# EAGLE design ME433_HW2_2 (EAGLE 8.1.0)
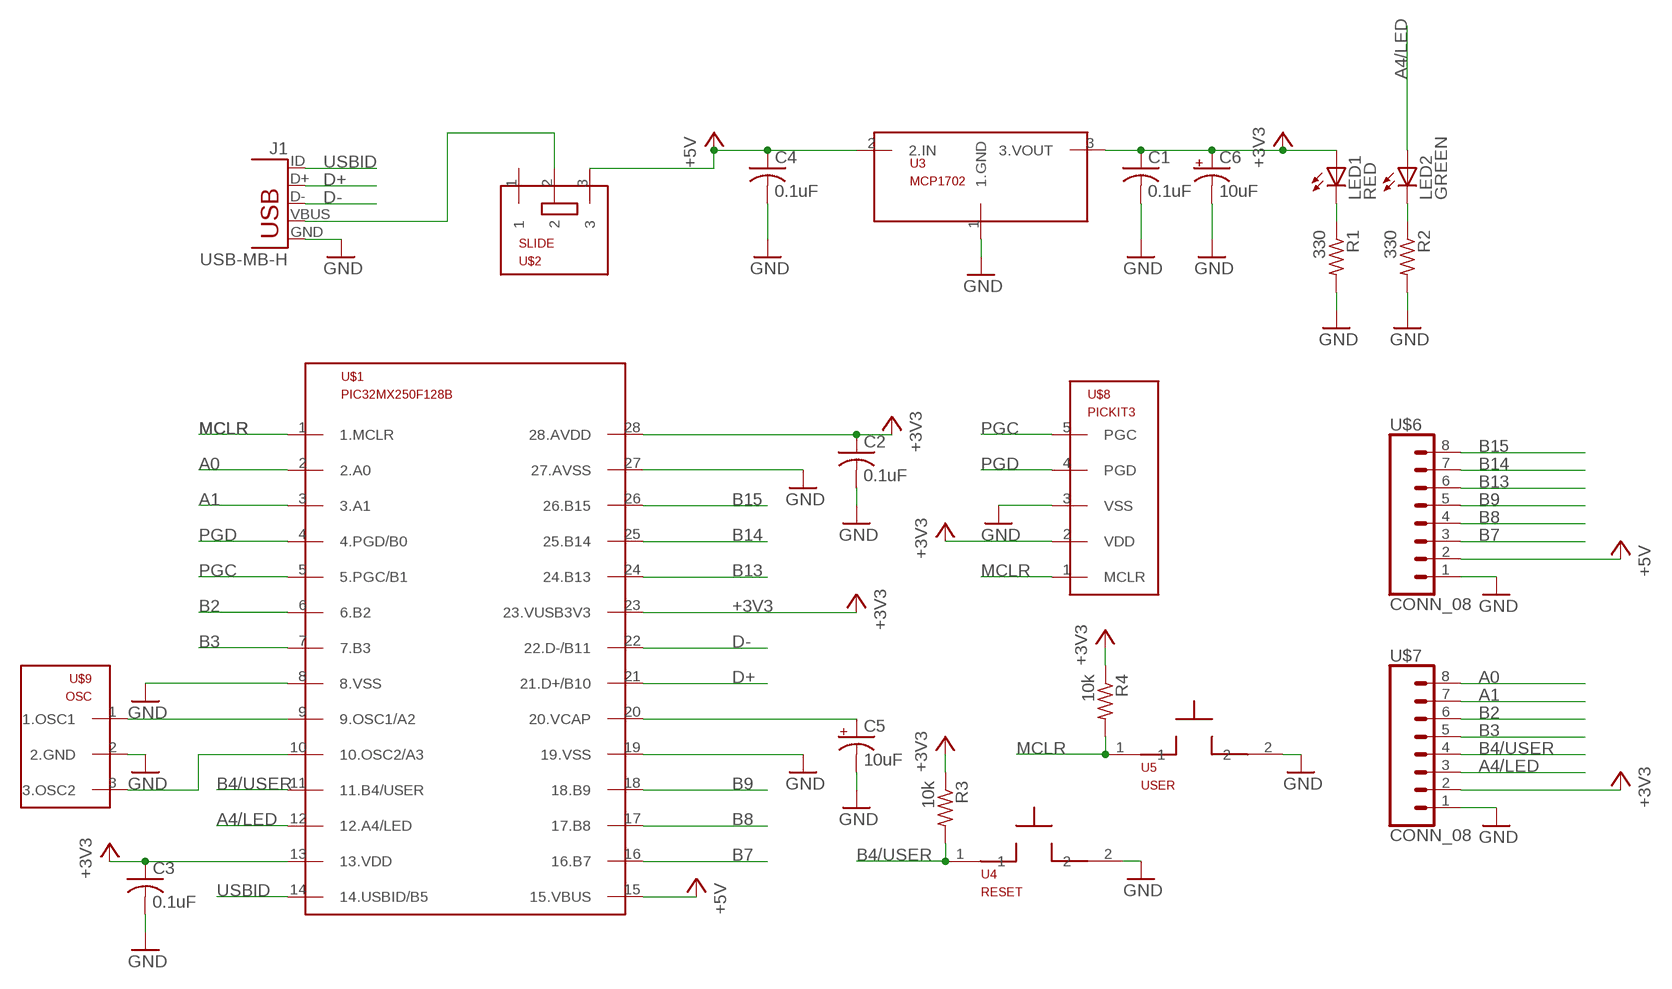
[diagram p0: schematic, sheet 1]

## Parts
C1  0.1uF  C-US025-025X050  [C025-025X050]
C2  0.1uF  C-US025-025X050  [C025-025X050]
C3  0.1uF  C-US025-025X050  [C025-025X050]
C4  0.1uF  C-US025-025X050  [C025-025X050]
C5  10uF  CPOL-USB45181B  [B45181B]
C6  10uF  CPOL-USB45181B  [B45181B]
J1  USB-MB-H  [USB-MB-H]
LED1  RED  LED3MM  [LED3MM]
LED2  GREEN  LED3MM  [LED3MM]
R1  330  R-US_0207/10  [0207/10]
R2  330  R-US_0207/10  [0207/10]
R3  10k  R-US_0207/10  [0207/10]
R4  10k  R-US_0207/10  [0207/10]
U3  MCP1702  [TO92]
U4  RESET  PB  [PB]
U5  USER  PB  [PB]
U$1  PIC32MX250F128B  [DIL28-3]
U$2  SLIDE  [SLIDE]
U$6  CONN_08  [1X08]
U$7  CONN_08  [1X08]
U$8  PICKIT3  [1X05]
U$9  OSC  [OSC]

## Nets
+3V3: C1.1 C2.1 C3.1 C6.+ LED1.A R3.1 R4.1 U3.3(3.VOUT) U$1.13(13.VDD) U$1.23(23.VUSB3V3) U$1.28(28.AVDD) U$7.2 U$8.2(VDD)
+5V: C4.1 U3.2(2.IN) U$1.15(15.VBUS) U$2.3 U$6.2
A0: U$1.2(2.A0) U$7.8
A1: U$1.3(3.A1) U$7.7
A4/LED: LED2.A U$1.12(12.A4/LED) U$7.3
B2: U$1.6(6.B2) U$7.6
B3: U$1.7(7.B3) U$7.5
B4/USER: R3.2 U4.1 U$1.11(11.B4/USER) U$7.4
B7: U$1.16(16.B7) U$6.3
B8: U$1.17(17.B8) U$6.4
B9: U$1.18(18.B9) U$6.5
B13: U$1.24(24.B13) U$6.6
B14: U$1.25(25.B14) U$6.7
B15: U$1.26(26.B15) U$6.8
D+: J1.D+ U$1.21(21.D+/B10)
D-: J1.D- U$1.22(22.D-/B11)
GND: C1.2 C2.2 C3.2 C4.2 C5.- C6.- J1.GND R1.2 R2.2 U3.1(1.GND) U4.2 U5.2 U$1.8(8.VSS) U$1.19(19.VSS) U$1.27(27.AVSS) U$6.1 U$7.1 U$8.3(VSS) U$9.2(2.GND)
MCLR: R4.2 U5.1 U$1.1(1.MCLR) U$8.1(MCLR)
N$2: LED1.K(C) R1.1
N$3: LED2.K(C) R2.1
N$5: U$1.10(10.OSC2/A3) U$9.3(3.OSC2)
N$6: U$1.9(9.OSC1/A2) U$9.1(1.OSC1)
N$7: C5.+ U$1.20(20.VCAP)
PGC: U$1.5(5.PGC/B1) U$8.5(PGC)
PGD: U$1.4(4.PGD/B0) U$8.4(PGD)
USBID: J1.ID U$1.14(14.USBID/B5)
VBUS: J1.VBUS U$2.2
Unconnected: U$2.1

## Library data of the parts
C1-C4 = resistor:C-US: CAPACITOR, American symbol
C5 C6 = resistor:CPOL-US: POLARIZED CAPACITOR, American symbol
J1 = ME433_HW2:USB: USB Connectors USB-B-PTH is fully proven SKU : PRT-00139/CONN-08278 USB-miniB is fully proven SKU : PRT-00587 USB-A-PCB is untested. USB-A-H is throughly reviewed, but untested. Spark Fun Electronics SKU : PRT-00437 USB-B-SMT is throughly reviewed, but untested. Needs silkscreen touching up. USB-A-S has not been used/tested USB-MB-H has not been used/tested USB-MICROB has been used. CONN-09505
LED1 LED2 = led:LED: LED OSRAM: - CHIPLED LG R971, LG N971, LY N971, LG Q971, LY Q971, LO R971, LY R971 LH N974, LH R974 LS Q976, LO Q976, LY Q976 LO Q996 - Hyper CHIPLED LW Q18S LB Q993, LB Q99A, LB R99A - SideLED LS A670, LO A670, LY A670, LG A670, LP A670 LB A673, LV A673, LT A673, LW A673 LH A674 LY A675 LS A676, LA A676, LO A676, LY A676, LW A676 LS A679, LY A679, LG A679 - Hyper Micro SIDELED® LS Y876, LA Y876, LO Y876, LY Y876 LT Y87S - SmartLED LW L88C, LW L88S LB L89C, LB L89S, LG L890 LS L89K, LO L89K, LY L89K LS L896, LA L896, LO L896, LY L896 - TOPLED LS T670, LO T670, LY T670, LG T670, LP T670 LSG T670, LSP T670, LSY T670, LOP T670, LYG T670 LG T671, LOG T671, LSG T671 LB T673, LV T673, LT T673, LW T673 LH T674 LS T676, LA T676, LO T676, LY T676, LB T676, LH T676, LSB T676, LW T676 LB T67C, LV T67C, LT T67C, LS T67K, LO T67K, LY T67K, LW E67C LS E67B, LA E67B, LO E67B, LY E67B, LB E67C, LV E67C, LT E67C LW T67C LS T679, LY T679, LG T679 LS T770, LO T770, LY T770, LG T770, LP T770 LB T773, LV T773, LT T773, LW T773 LH T774 LS E675, LA E675, LY E675, LS T675 LS T776, LA T776, LO T776, LY T776, LB T776 LHGB T686 LT T68C, LB T68C - Hyper Mini TOPLED® LB M676 - Mini TOPLED Santana® LG M470 LS M47K, LO M47K, LY M47K Source: http://www.osram.convergy.de LUXEON: - LUMILED® LXK2-PW12-R00, LXK2-PW12-S00, LXK2-PW14-U00, LXK2-PW14-V00 LXK2-PM12-R00, LXK2-PM12-S00, LXK2-PM14-U00 LXK2-PE12-Q00, LXK2-PE12-R00, LXK2-PE12-S00, LXK2-PE14-T00, LXK2-PE14-U00 LXK2-PB12-K00, LXK2-PB12-L00, LXK2-PB12-M00, LXK2-PB14-N00, LXK2-PB14-P00, LXK2-PB14-Q00 LXK2-PR12-L00, LXK2-PR12-M00, LXK2-PR14-Q00, LXK2-PR14-R00 LXK2-PD12-Q00, LXK2-PD12-R00, LXK2-PD12-S00 LXK2-PH12-R00, LXK2-PH12-S00 LXK2-PL12-P00, LXK2-PL12-Q00, LXK2-PL12-R00 Source: www.luxeon.com KINGBRIGHT: KA-3528ASYC Source: www.kingbright.com
R1-R4 = resistor:R-US_: RESISTOR, American symbol
U3 = ME433_HW2:MCP1702
U4 U5 = ME433_HW2:PB
U$1 = ME433_HW2:PIC32MX250F128B
U$2 = ME433_HW2:SLIDE
U$6 U$7 = ME433_HW2:CONN_08
U$8 = ME433_HW2:PICKIT3
U$9 = ME433_HW2:OSC

## Board
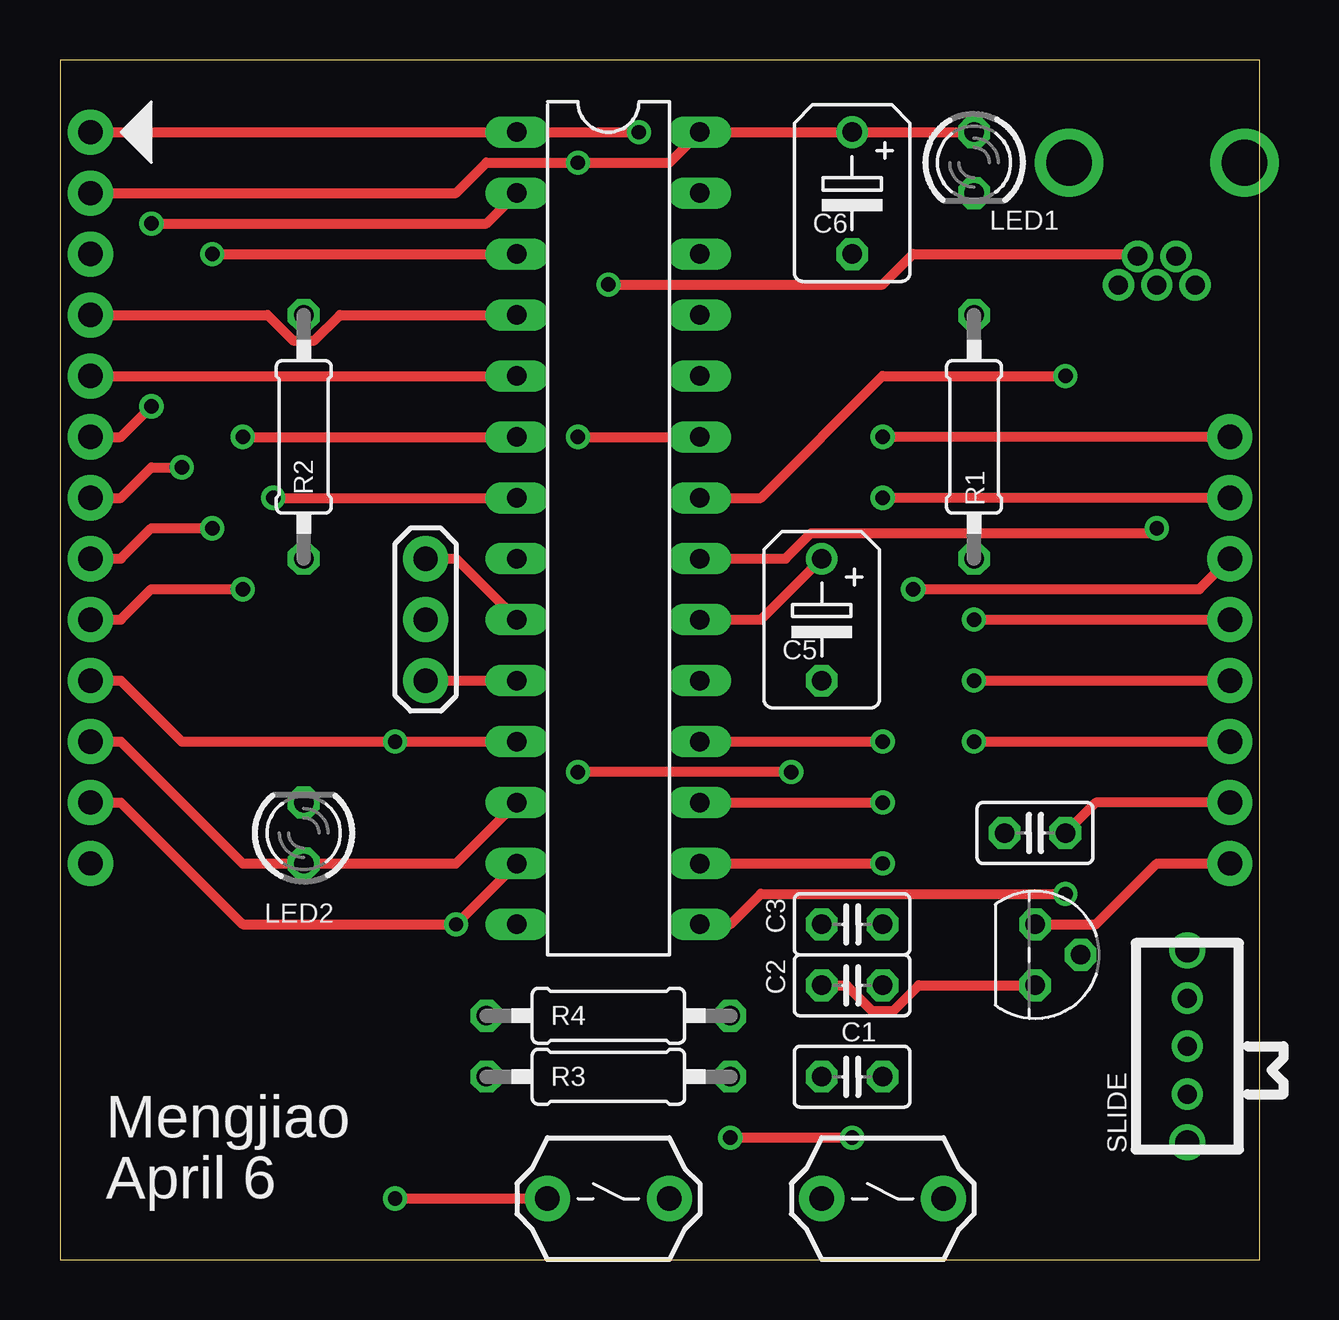
[diagram p1: board, top side]
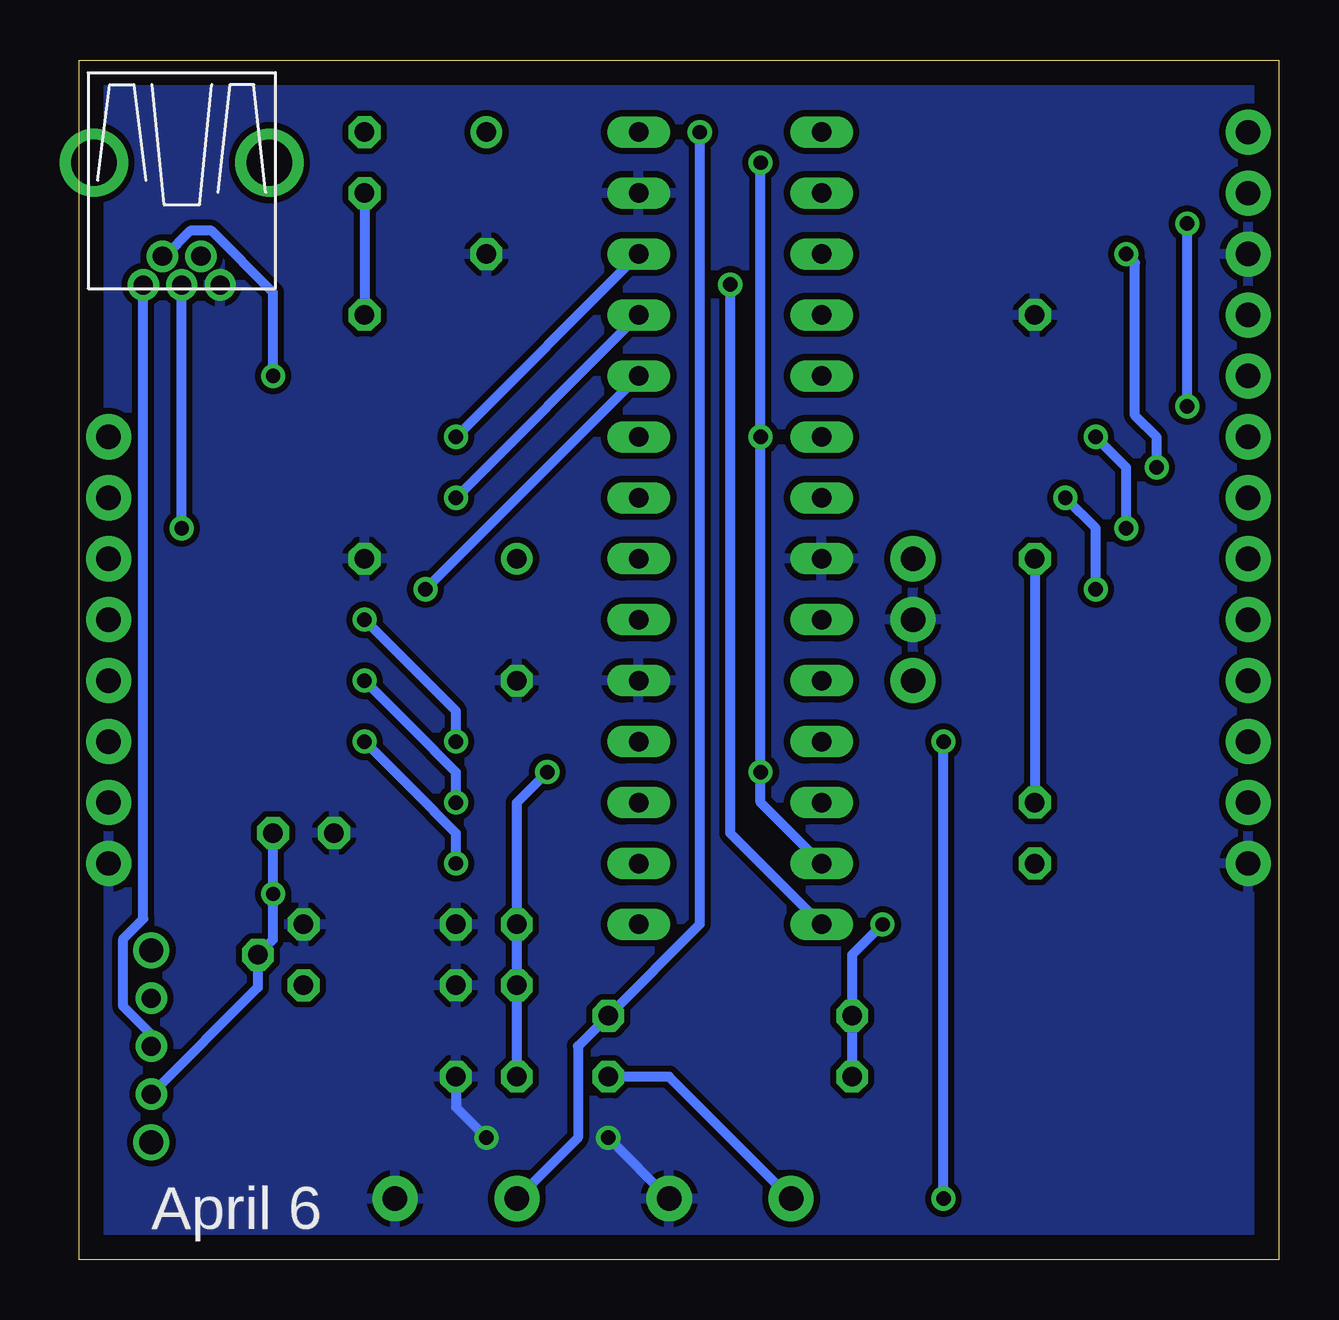
[diagram p2: board, bottom side, seen from below]

Size 50 x 50 mm. Coordinates in mm from the lower left corner, seen from the top.
Outline: 0,0 50,0 50,50 0,50 0,0
Copper layers (1*16): Top 0.035mm / dielectric 1.5mm / Bottom 0.035mm
Design rules "default": minimum track width 10mil, minimum drill 24mil, track to track 8mil, track to pad 8mil, pad to pad 8mil, via to via 8mil, smd to smd 8mil, copper to edge 40mil, drill to drill 8mil, minimum pad ring 10mil, minimum via ring 8mil, stop-mask expansion 4mil, vias tented up to drill 0mil, thermal gap 10mil

### Footprints (pad centres in the part's own frame; a part is rotated, then mirrored left to right if it is on the bottom)
C025-025X050 = drill 0.813 octagon: 1 -1.27,0; 2 1.27,0
B45181B = drill 0.813: + -2.54,0 | drill 0.813 octagon: - 2.54,0
USB-MB-H = drill 0.8: D+ 5.1,0; D- 3.9,0.8; GND 5.1,-1.6; ID 3.9,-0.8; VBUS 5.1,1.6 | drill 1.9: P$6 0,-3.65; P$7 0,3.65
LED3MM = drill 0.813 octagon: A -1.27,0; K 1.27,0
0207/10 = drill 0.813 octagon: 1 -5.08,0; 2 5.08,0
TO92 = drill 0.813 octagon: 1 -1.27,0; 2 0,1.905; 3 1.27,0
PB = drill 1.016 pad 1.88: 1 -2.54,0; 2 2.54,0
DIL28-3 = drill 0.813 long: 1 -16.51,-3.81; 2 -13.97,-3.81; 3 -11.43,-3.81; 4 -8.89,-3.81; 5 -6.35,-3.81; 6 -3.81,-3.81; 7 -1.27,-3.81; 8 1.27,-3.81; 9 3.81,-3.81; 10 6.35,-3.81; 11 8.89,-3.81; 12 11.43,-3.81; 13 13.97,-3.81; 14 16.51,-3.81; 15 16.51,3.81; 16 13.97,3.81; 17 11.43,3.81; 18 8.89,3.81; 19 6.35,3.81; 20 3.81,3.81; 21 1.27,3.81; 22 -1.27,3.81; 23 -3.81,3.81; 24 -6.35,3.81; 25 -8.89,3.81; 26 -11.43,3.81; 27 -13.97,3.81; 28 -16.51,3.81
SLIDE = drill 0.8: 1 -2,0; 2 0,0; 3 2,0 | drill 1: P$1 -4,0; P$2 4,0
1X08 = drill 1.016 pad 1.88: 1 0,0; 2 2.54,0; 3 5.08,0; 4 7.62,0; 5 10.16,0; 6 12.7,0; 7 15.24,0; 8 17.78,0
1X05 = drill 1.016 pad 1.88: 1 0,0; 2 2.54,0; 3 5.08,0; 4 7.62,0; 5 10.16,0
OSC = drill 1.016 pad 1.88: 1 -2.54,0; 2 0,0; 3 2.54,0

### Placement (x,y rotation side)
C1  33.02,7.62 0 top
C2  33.02,11.43 0 top
C3  33.02,13.97 0 top
C4  40.64,17.78 180 top
C5  31.75,26.67 270 top
C6  33.02,44.45 270 top
J1  45.72,45.72 270 top
LED1  38.1,45.72 270 top
LED2  10.16,17.78 90 top
R1  38.1,34.29 270 top
R2  10.16,34.29 90 top
R3  22.86,7.62 0 top
R4  22.86,10.16 0 top
U3  40.64,12.7 270 top
U4  22.86,2.54 0 top
U5  34.29,2.54 0 top
U$1  22.86,30.48 270 top
U$2  46.99,8.89 270 top
U$6  48.77,16.51 90 top
U$7  1.27,16.51 90 top
U$8  1.27,46.99 270 top
U$9  15.24,26.67 270 top

### Tracks (layer width: path | path; a pad name or v marks a point on that pad's centre or on a via)
+3V3  (via drill 0.6)
  Top 0.406: v21.59,34.29 U$1.23 | U$8.2 16.51,44.45 17.78,45.72 v21.59,45.72 25.4,45.72 U$1.28 C6.+ LED1.A | U$7.2 2.54,19.05 7.62,13.97 v16.51,13.97 U$1.13 | v30.48,20.32 v21.59,20.32 | C2.1 32.78,11.43 33.85,10.36 34.73,10.36 35.8,11.43 U3.3
  Bottom 0.406: U$1.13 21.59,19.05 v21.59,20.32 v21.59,34.29 v21.59,45.72 | v16.51,13.97 17.78,12.7 R4.1 R3.1 | C1.1 C2.1 C3.1 31.75,19.05 v30.48,20.32
+5V  (via drill 0.6)
  Top 0.406: U$1.15 27.94,13.97 29.21,15.24 v41.91,15.24 | U$6.2 43.18,19.05 C4.1
  Bottom 0.406: C4.1 v41.91,15.24 41.91,13.34 U3.2 | 42.55,12.61 U3.2 | U3.2 42.55,11.34 U$2.3
A0  (via drill 0.6)
  Top 0.406: U$7.8 2.54,34.29 v3.81,35.56 | v3.81,43.18 17.78,43.18 U$1.2
  Bottom 0.406: v3.81,35.56 v3.81,43.18
A1  (via drill 0.6)
  Top 0.406: U$7.7 2.54,31.75 3.81,33.02 v5.08,33.02 | v6.35,41.91 U$1.3
  Bottom 0.406: v5.08,33.02 5.08,34.27 5.99,35.18 5.99,41.55 v6.35,41.91
A4/LED
  Top 0.406: U$7.3 2.54,21.59 7.62,16.51 LED2.A 16.51,16.51 U$1.12
B2  (via drill 0.6)
  Top 0.406: U$7.6 2.54,29.21 3.81,30.48 v6.35,30.48 | v7.62,34.29 U$1.6
  Bottom 0.406: v6.35,30.48 6.35,33.02 v7.62,34.29
B3  (via drill 0.6)
  Top 0.406: U$7.5 2.54,26.67 3.81,27.94 v7.62,27.94 | v8.89,31.75 U$1.7
  Bottom 0.406: v7.62,27.94 7.62,30.48 v8.89,31.75
B4/USER  (via drill 0.6)
  Top 0.406: U$7.4 2.54,24.13 5.08,21.59 v13.97,21.59 U$1.11 | U4.1 v13.97,2.54
  Bottom 0.406: R3.2 25.4,7.62 U4.1 | v13.97,2.54 v13.97,21.59
B7  (via drill 0.6)
  Top 0.406: U$1.16 v34.29,16.51 | v38.1,21.59 U$6.3
  Bottom 0.406: v38.1,21.59 35.2,18.69 35.2,18.67 34.29,17.76 v34.29,16.51
B8  (via drill 0.6)
  Top 0.406: U$1.17 v34.29,19.05 | v38.1,24.13 U$6.4
  Bottom 0.406: v38.1,24.13 35.2,21.23 35.2,21.21 34.29,20.3 v34.29,19.05
B9  (via drill 0.6)
  Top 0.406: U$1.18 v34.29,21.59 | v38.1,26.67 U$6.5
  Bottom 0.406: v34.29,21.59 34.29,22.86 v38.1,26.67
B13  (via drill 0.6)
  Top 0.406: v35.56,27.94 47.5,27.94 U$6.6
  Bottom 0.406: U$1.24 v35.56,27.94
B14  (via drill 0.6)
  Top 0.406: U$6.7 v34.29,31.75
  Bottom 0.406: v34.29,31.75 U$1.25
B15  (via drill 0.6)
  Top 0.406: U$6.8 v34.29,34.29
  Bottom 0.406: v34.29,34.29 U$1.26
D+  (via drill 0.6)
  Top 0.406: U$1.21 30.24,29.21 31.31,30.28 45.52,30.28 v45.72,30.48
  Bottom 0.406: v45.72,30.48 J1.D+
D-  (via drill 0.6)
  Top 0.406: U$1.22 29.21,31.75 34.29,36.83 v41.91,36.83
  Bottom 0.406: J1.D- 46.42,41.82 45.36,42.88 44.48,42.88 41.91,40.31 v41.91,36.83
GND  (via drill 0.6)
  Top 0.406: U3.1 43.18,13.97 45.72,16.51 U$6.1 | v33.02,5.08 v27.94,5.08
  Bottom 0.406: C1.2 34.29,6.35 v33.02,5.08 | v27.94,5.08 U4.2
  pour Bottom (isolate 0.254): 0,49.53 50.8,49.53 50.8,0 0,0
MCLR  (via drill 0.6)
  Top 0.406: U$8.1 U$1.1 v24.13,46.99
  Bottom 0.406: v24.13,46.99 24.13,13.97 R4.2 29.21,8.89 29.21,5.08 U5.1
N$2
  Bottom 0.406: LED1.K R1.1
N$3
  Bottom 0.406: R2.1 LED2.K
N$5
  Top 0.406: U$9.3 U$1.10
N$6
  Top 0.406: U$9.1 16.51,29.21 U$1.9
N$7
  Top 0.406: U$1.20 29.21,26.67 C5.+
PGC
  Top 0.406: U$8.5 U$1.5
PGD
  Top 0.406: U$8.4 8.65,39.37 9.72,38.3 10.6,38.3 11.67,39.37 U$1.4
USBID  (via drill 0.6)
  Top 0.406: 23.06,40.84 v22.86,40.64 34.29,40.64 35.56,41.91 44.83,41.91 J1.ID
  Bottom 0.406: v22.86,40.64 22.86,17.78 U$1.14
VBUS
  Bottom 0.406: U$2.2 46.99,9.39 48.15,10.55 48.15,13.37 47.32,14.2 J1.VBUS

### Text on the board
tPlace: Mengjiao | April 6
bPlace: April 6